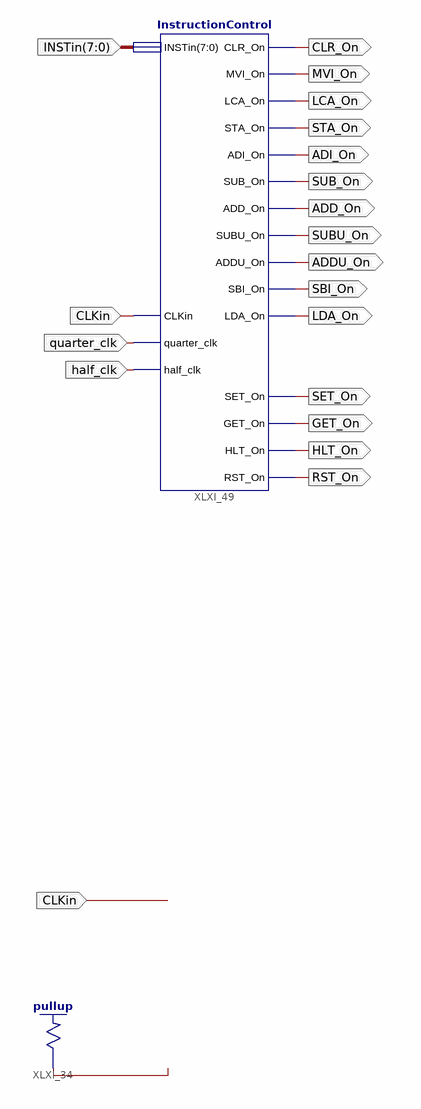
[diagram p0: schematic sheet 1]
// Xilinx ISE schematic ControlUnit.sch (spartan3e) as structural Verilog: 2 symbols, 19 ports
module ControlUnit (
  input  CLKin,
  input  [7:0] INSTin,
  input  half_clk,
  input  quarter_clk,
  output CLR_On,
  output MVI_On,
  output LCA_On,
  output STA_On,
  output ADI_On,
  output SUB_On,
  output ADD_On,
  output SUBU_On,
  output ADDU_On,
  output SBI_On,
  output LDA_On,
  output SET_On,
  output GET_On,
  output HLT_On,
  output RST_On
);

  wire CE;

  \pullup  XLXI_34 (.O(CE));
  InstructionControl XLXI_49 (
    .CLKin(CLKin), .quarter_clk(quarter_clk), .half_clk(half_clk), .INSTin(INSTin), .CLR_On(CLR_On),
    .MVI_On(MVI_On), .LCA_On(LCA_On), .STA_On(STA_On), .ADI_On(ADI_On), .SUB_On(SUB_On), .ADD_On(ADD_On),
    .SUBU_On(SUBU_On), .ADDU_On(ADDU_On), .SBI_On(SBI_On), .LDA_On(LDA_On), .SET_On(SET_On), .GET_On(GET_On),
    .HLT_On(HLT_On), .RST_On(RST_On));
endmodule
